# EAGLE design EC-TDS-PPM1_5 (EAGLE 7.5.0)
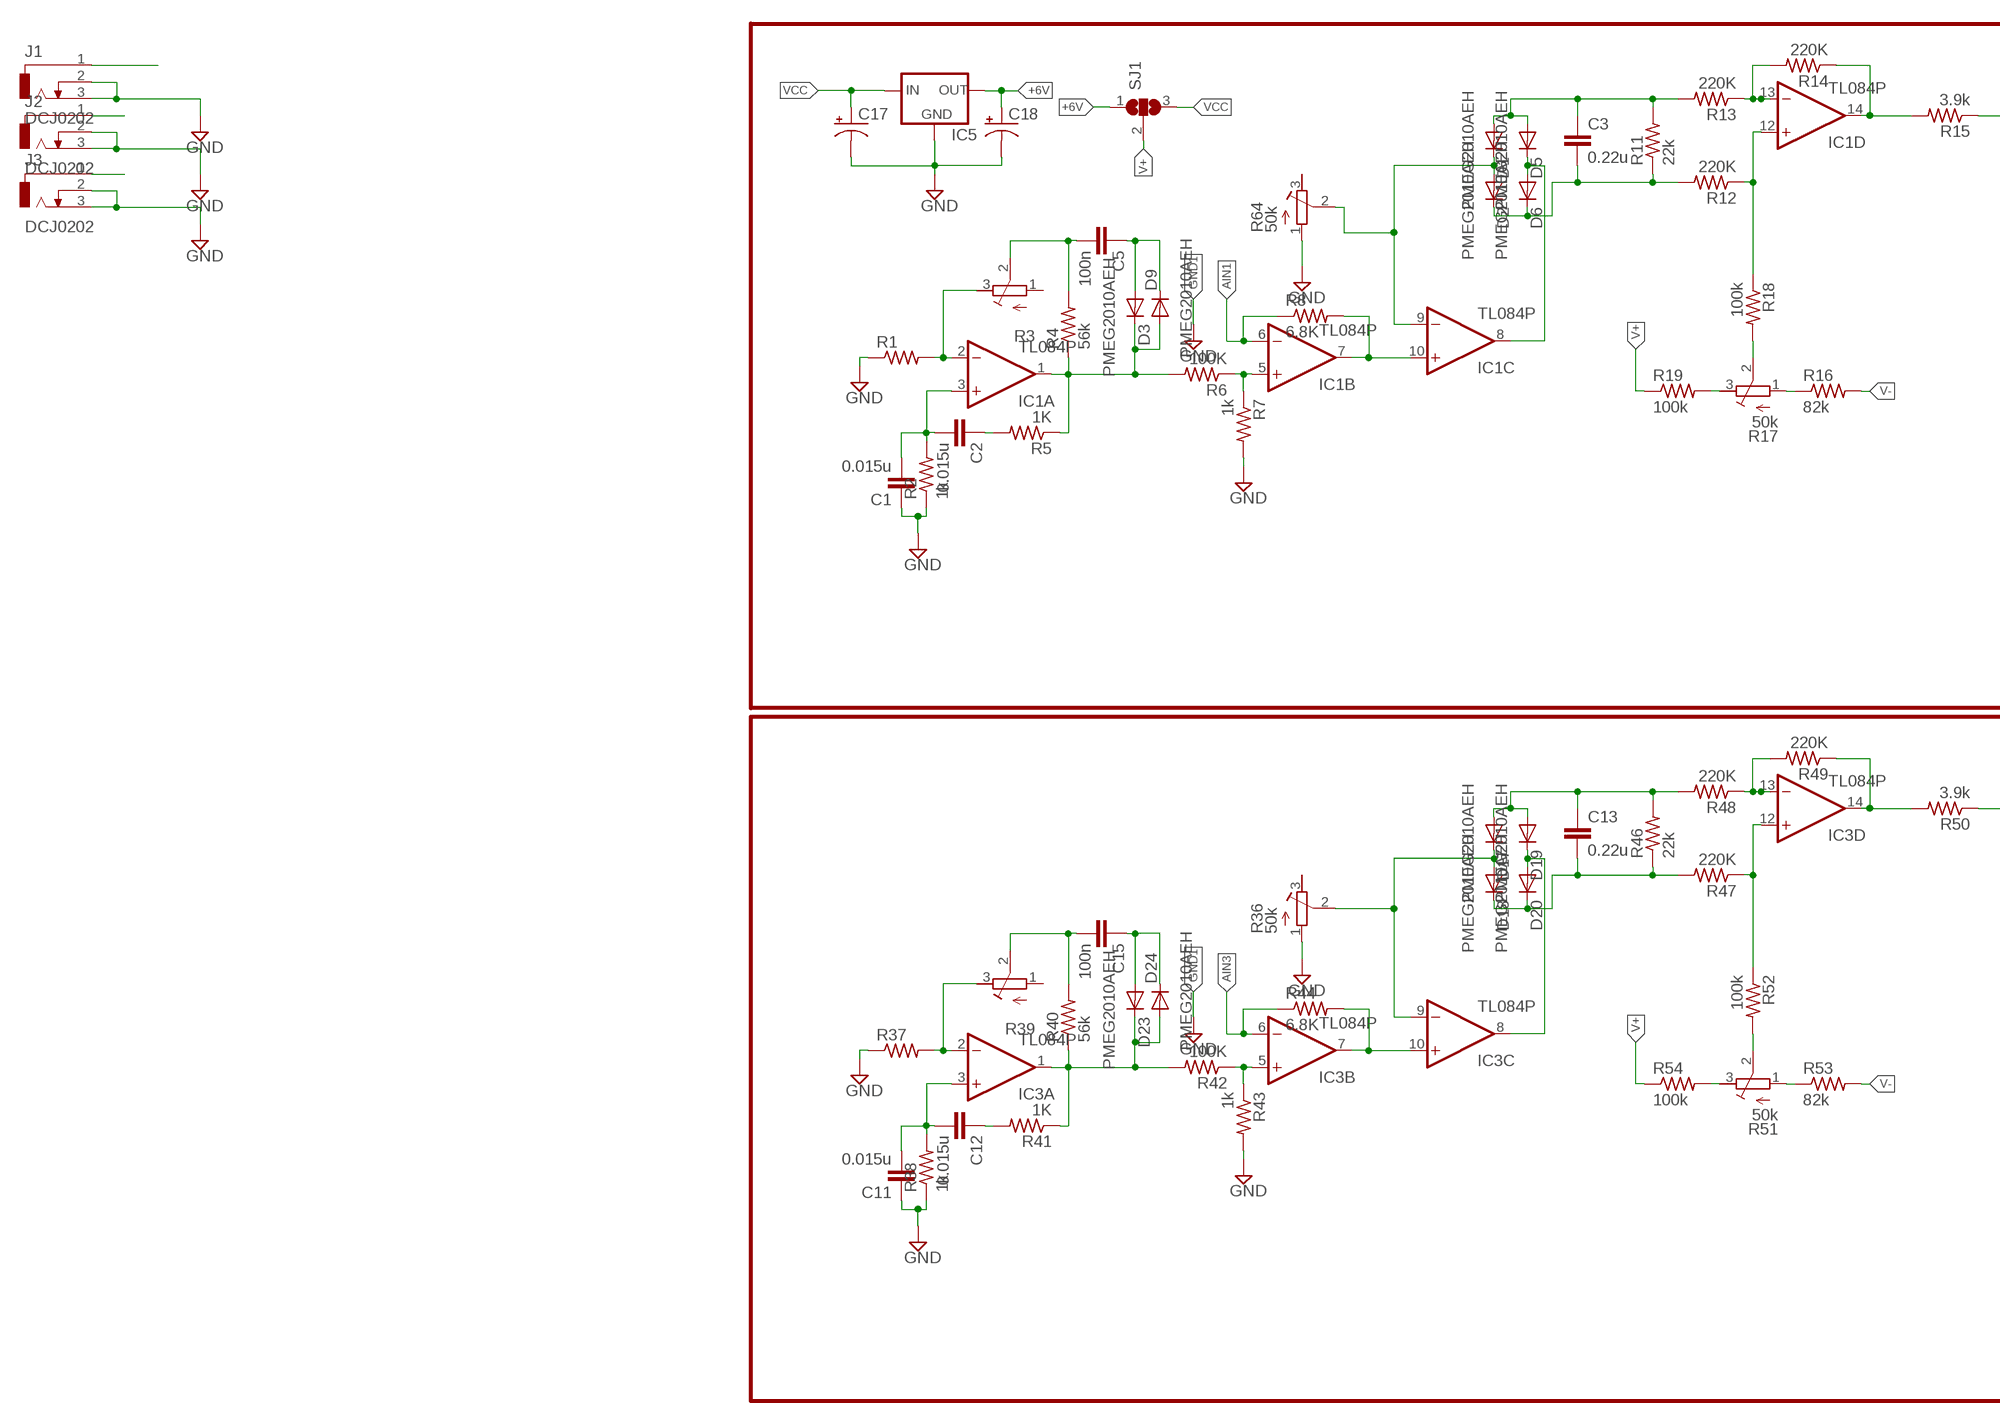
[diagram p0: schematic, sheet 1, part 1 of 2]
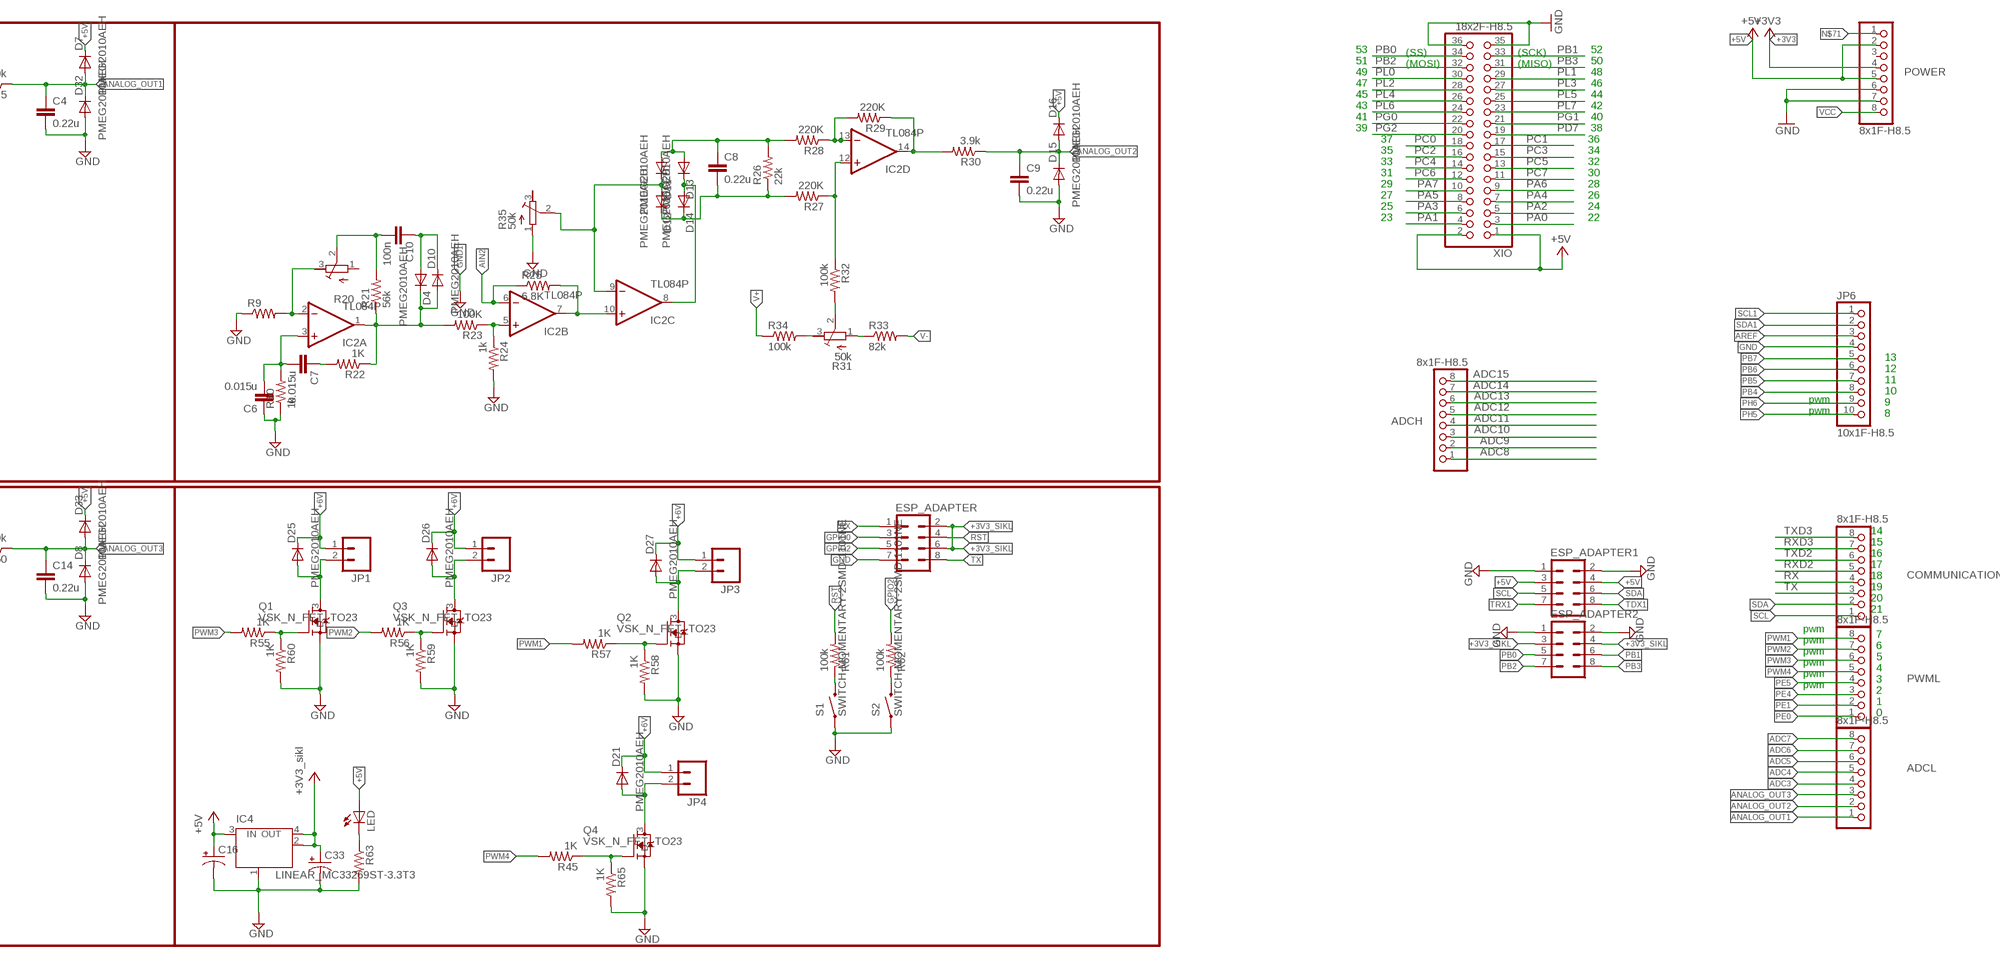
[diagram p1: schematic, sheet 1, part 2 of 2]

## Parts
ADCH  8x1F-H8.5  PINHD-1X8  [1X08]
ADCL  8x1F-H8.5  PINHD-1X8  [1X08]
C1  0.015u  C-EUC0603  [C0603]
C2  0.015u  C-EUC0603  [C0603]
C3  0.22u  C-EUC0603  [C0603]
C4  0.22u  C-EUC0603  [C0603]
C5  100n  C-EUC0603  [C0603]
C6  0.015u  C-EUC0603  [C0603]
C7  0.015u  C-EUC0603  [C0603]
C8  0.22u  C-EUC0603  [C0603]
C9  0.22u  C-EUC0603  [C0603]
C10  100n  C-EUC0603  [C0603]
C11  0.015u  C-EUC0603  [C0603]
C12  0.015u  C-EUC0603  [C0603]
C13  0.22u  C-EUC0603  [C0603]
C14  0.22u  C-EUC0603  [C0603]
C15  100n  C-EUC0603  [C0603]
C16  CPOL-USSMCC  [SMC_C]
C17  CPOL-USSMCC  [SMC_C]
C18  CPOL-USSMCC  [SMC_C]
C33  CPOL-USSMCC  [SMC_C]
COMMUNICATION  8x1F-H8.5  PINHD-1X8  [1X08]
D1  PMEG2010AEH  DIOD_SOT123F  [SOT123F]
D2  PMEG2010AEH  DIOD_SOT123F  [SOT123F]
D3  PMEG2010AEH  DIOD_SOT123F  [SOT123F]
D4  PMEG2010AEH  DIOD_SOT123F  [SOT123F]
D5  PMEG2010AEH  DIOD_SOT123F  [SOT123F]
D6  PMEG2010AEH  DIOD_SOT123F  [SOT123F]
D7  PMEG2010AEH  DIOD_SOT123F  [SOT123F]
D8  PMEG2010AEH  DIOD_SOT123F  [SOT123F]
D9  PMEG2010AEH  DIOD_SOT123F  [SOT123F]
D10  PMEG2010AEH  DIOD_SOT123F  [SOT123F]
D11  PMEG2010AEH  DIOD_SOT123F  [SOT123F]
D12  PMEG2010AEH  DIOD_SOT123F  [SOT123F]
D13  PMEG2010AEH  DIOD_SOT123F  [SOT123F]
D14  PMEG2010AEH  DIOD_SOT123F  [SOT123F]
D15  PMEG2010AEH  DIOD_SOT123F  [SOT123F]
D16  PMEG2010AEH  DIOD_SOT123F  [SOT123F]
D17  PMEG2010AEH  DIOD_SOT123F  [SOT123F]
D18  PMEG2010AEH  DIOD_SOT123F  [SOT123F]
D19  PMEG2010AEH  DIOD_SOT123F  [SOT123F]
D20  PMEG2010AEH  DIOD_SOT123F  [SOT123F]
D21  PMEG2010AEH  DIOD_SOT123F  [SOT123F]
D23  PMEG2010AEH  DIOD_SOT123F  [SOT123F]
D24  PMEG2010AEH  DIOD_SOT123F  [SOT123F]
D25  PMEG2010AEH  DIOD_SOT123F  [SOT123F]
D26  PMEG2010AEH  DIOD_SOT123F  [SOT123F]
D27  PMEG2010AEH  DIOD_SOT123F  [SOT123F]
D32  PMEG2010AEH  DIOD_SOT123F  [SOT123F]
D33  PMEG2010AEH  DIOD_SOT123F  [SOT123F]
ESP_ADAPTER  M04X2  [2X4]
ESP_ADAPTER1  M04X2  [2X4]
ESP_ADAPTER2  M04X2  [2X4]
IC1  TL084P  [DIL14]
IC2  TL084P  [DIL14]
IC3  TL084P  [DIL14]
IC4  LINEAR_MC33269ST-3.3T3  [LINEAR_SOT223]
IC5  78XXS  [78XXS]
J1  DCJ0202  [DCJ0202]
J2  DCJ0202  [DCJ0202]
J3  DCJ0202  [DCJ0202]
JP1  M02PTH  [1X02]
JP2  M02PTH  [1X02]
JP3  M02PTH  [1X02]
JP4  M02PTH  [1X02]
JP6  10x1F-H8.5  PINHD-1X10_ARD  [1X10]
LED  SPARKFUN_LED0603  [SPARKFUN_LED-0603]
POWER  8x1F-H8.5  PINHD-1X8  [1X08]
PWML  8x1F-H8.5  PINHD-1X8  [1X08]
Q1  VSK_N_FET_TO23  [SOT23]
Q2  VSK_N_FET_TO23  [SOT23]
Q3  VSK_N_FET_TO23  [SOT23]
Q4  VSK_N_FET_TO23  [SOT23]
R1  R-US_R0603  [R0603]
R2  1k  R-US_R0603  [R0603]
R3  R-TRIMM64W  [RTRIM64W]
R4  56k  R-US_R0603  [R0603]
R5  1K  R-US_R0603  [R0603]
R6  100K  R-US_R0603  [R0603]
R7  1k  R-US_R0603  [R0603]
R8  6.8K  R-US_R0603  [R0603]
R9  R-US_R0603  [R0603]
R10  1k  R-US_R0603  [R0603]
R11  22k  R-US_R0603  [R0603]
R12  220K  R-US_R0603  [R0603]
R13  220K  R-US_R0603  [R0603]
R14  220K  R-US_R0603  [R0603]
R15  3.9k  R-US_R0603  [R0603]
R16  82k  R-US_R0603  [R0603]
R17  50k  R-TRIMM64W  [RTRIM64W]
R18  100k  R-US_R0603  [R0603]
R19  100k  R-US_R0603  [R0603]
R20  R-TRIMM64W  [RTRIM64W]
R21  56k  R-US_R0603  [R0603]
R22  1K  R-US_R0603  [R0603]
R23  100K  R-US_R0603  [R0603]
R24  1k  R-US_R0603  [R0603]
R25  6.8K  R-US_R0603  [R0603]
R26  22k  R-US_R0603  [R0603]
R27  220K  R-US_R0603  [R0603]
R28  220K  R-US_R0603  [R0603]
R29  220K  R-US_R0603  [R0603]
R30  3.9k  R-US_R0603  [R0603]
R31  50k  R-TRIMM64W  [RTRIM64W]
R32  100k  R-US_R0603  [R0603]
R33  82k  R-US_R0603  [R0603]
R34  100k  R-US_R0603  [R0603]
R35  50k  R-TRIMM64W  [RTRIM64W]
R36  50k  R-TRIMM64W  [RTRIM64W]
R37  R-US_R0603  [R0603]
R38  1k  R-US_R0603  [R0603]
R39  R-TRIMM64W  [RTRIM64W]
R40  56k  R-US_R0603  [R0603]
R41  1K  R-US_R0603  [R0603]
R42  100K  R-US_R0603  [R0603]
R43  1k  R-US_R0603  [R0603]
R44  6.8K  R-US_R0603  [R0603]
R45  1K  R-US_R0603  [R0603]
R46  22k  R-US_R0603  [R0603]
R47  220K  R-US_R0603  [R0603]
R48  220K  R-US_R0603  [R0603]
R49  220K  R-US_R0603  [R0603]
R50  3.9k  R-US_R0603  [R0603]
R51  50k  R-TRIMM64W  [RTRIM64W]
R52  100k  R-US_R0603  [R0603]
R53  82k  R-US_R0603  [R0603]
R54  100k  R-US_R0603  [R0603]
R55  1K  R-US_R0603  [R0603]
R56  1K  R-US_R0603  [R0603]
R57  1K  R-US_R0603  [R0603]
R58  1K  R-US_R0603  [R0603]
R59  1K  R-US_R0603  [R0603]
R60  1K  R-US_R0603  [R0603]
R61  100k  R-US_R0603  [R0603]
R62  100k  R-US_R0603  [R0603]
R63  SPARKFUN_RESISTOR0603-RES  [SPARKFUN_0603-RES]
R64  50k  R-TRIMM64W  [RTRIM64W]
R65  1K  R-US_R0603  [R0603]
S1  SWITCH-MOMENTARY-2SMD-1101NE  [TACTILE-SWITCH-1101NE]
S2  SWITCH-MOMENTARY-2SMD-1101NE  [TACTILE-SWITCH-1101NE]
SJ1  SJ2WW  [SJ_2W]
XIO  18x2F-H8.5  PINHD-2X18  [2X18]

## Nets
+3V3: POWER.4
+3V3_SIKL: C33.+ ESP_ADAPTER2.3 ESP_ADAPTER2.4 ESP_ADAPTER.2 ESP_ADAPTER.6 IC4.2(OUT) IC4.4(OUT) ; supply symbol labelled +3V3_sikl
+5V: C16.+ D7.C D16.C D33.C ESP_ADAPTER1.3 ESP_ADAPTER1.4 IC4.3(IN) LED.A POWER.2 POWER.5 XIO.1 XIO.2
+6V: C18.+ D21.C D25.C D26.C D27.C IC5.OUT JP1.1 JP2.1 JP3.1 JP4.1 SJ1.1
ADC3: ADCL.4
ADC4: ADCL.5
ADC5: ADCL.6
ADC6: ADCL.7
ADC7: ADCL.8
ADC8: ADCH.1
ADC9: ADCH.2
ADC10: ADCH.3
ADC11: ADCH.4
ADC12: ADCH.5
ADC13: ADCH.6
ADC14: ADCH.7
ADC15: ADCH.8
AIN1: IC1.6(B:-IN) J1.1 R8.1
AIN2: IC2.6(B:-IN) J2.1 R25.1
AIN3: IC3.6(B:-IN) J3.1 R44.1
ANALOG_OUT1: ADCL.1 C4.1 D7.A D32.C R15.1
ANALOG_OUT2: ADCL.2 C9.1 D15.C D16.A R30.1
ANALOG_OUT3: ADCL.3 C14.1 D8.C D33.A R50.1
AREF: JP6.3
GND: ESP_ADAPTER.7 JP6.4 POWER.6 POWER.7 XIO.35 XIO.36
GND1: C1.1 C4.2 C6.1 C9.2 C11.1 C14.2 C16.- C17.- C18.- C33.- D8.A D15.A D32.A ESP_ADAPTER1.1 ESP_ADAPTER1.2 ESP_ADAPTER2.1 ESP_ADAPTER2.2 IC4.1(GND/ADJ) IC5.GND J1.2 J1.3 J2.2 J2.3 J3.2 J3.3 Q1.2(S) Q2.2(S) Q3.2(S) Q4.2(S) R1.1 R2.1 R7.2 R9.1 R10.1 R24.2 R35.1(A) R36.1(A) R37.1 R38.1 R43.2 R58.2 R59.2 R60.2 R63.2 R64.1(A) R65.2 S1.1 S2.1 ; supply symbol labelled GND
GPIO0: ESP_ADAPTER.3
GPIO2: ESP_ADAPTER.5 R62.2
N$1: IC1.2(A:-IN) R1.2 R3.3(E)
N$2: C2.1 R5.2
N$3: C1.2 C2.2 IC1.3(A:+IN) R2.2
N$4: IC1.5(B:+IN) R6.1 R7.1
N$5: C5.2 R3.2(S) R4.2
N$6: R16.1 R17.1(A)
N$7: D3.C D9.A IC1.1(A:OUT) R4.1 R5.1 R6.2
N$8: C5.1 D3.A D9.C
N$9: IC1.7(B:OUT) IC1.10(C:+IN) R8.2
N$10: R17.3(E) R19.2
N$11: IC1.13(D:-IN) R13.1 R14.2
N$12: C3.1 D1.A D5.A R11.2 R13.2
N$13: D1.C D2.A IC1.9(C:-IN) R64.2(S)
N$14: C3.2 D2.C D6.C R11.1 R12.2
N$15: D5.C D6.A IC1.8(C:OUT)
N$16: IC1.12(D:+IN) R12.1 R18.1
N$17: IC1.14(D:OUT) R14.1 R15.2
N$18: R17.2(S) R18.2
N$19: IC2.2(A:-IN) R9.2 R20.3(E)
N$20: C6.2 C7.2 IC2.3(A:+IN) R10.2
N$21: C10.2 R20.2(S) R21.2
N$22: D4.C D10.A IC2.1(A:OUT) R21.1 R22.1 R23.2
N$23: C7.1 R22.2
N$24: IC2.5(B:+IN) R23.1 R24.1
N$25: IC2.7(B:OUT) IC2.10(C:+IN) R25.2
N$26: C8.1 D11.A D13.A R26.2 R28.2
N$27: D11.C D12.A IC2.9(C:-IN) R35.2(S)
N$28: C8.2 D12.C D14.C R26.1 R27.2
N$29: D13.C D14.A IC2.8(C:OUT)
N$30: IC2.13(D:-IN) R28.1 R29.2
N$31: IC2.12(D:+IN) R27.1 R32.1
N$32: IC2.14(D:OUT) R29.1 R30.2
N$33: C10.1 D4.A D10.C
N$34: R31.1(A) R33.1
N$35: R31.3(E) R34.2
N$36: R31.2(S) R32.2
N$37: IC3.2(A:-IN) R37.2 R39.3(E)
N$38: C11.2 C12.2 IC3.3(A:+IN) R38.2
N$39: C15.2 R39.2(S) R40.2
N$40: D23.C D24.A IC3.1(A:OUT) R40.1 R41.1 R42.2
N$41: C12.1 R41.2
N$42: IC3.5(B:+IN) R42.1 R43.1
N$43: IC3.7(B:OUT) IC3.10(C:+IN) R44.2
N$44: C13.1 D17.A D19.A R46.2 R48.2
N$45: D17.C D18.A IC3.9(C:-IN) R36.2(S)
N$46: C13.2 D18.C D20.C R46.1 R47.2
N$47: D19.C D20.A IC3.8(C:OUT)
N$48: IC3.13(D:-IN) R48.1 R49.2
N$49: IC3.12(D:+IN) R47.1 R52.1
N$50: IC3.14(D:OUT) R49.1 R50.2
N$51: C15.1 D23.A D24.C
N$52: R51.1(A) R53.1
N$53: R51.3(E) R54.2
N$54: R51.2(S) R52.2
N$55: D26.A JP2.2 Q3.3(D)
N$56: D27.A JP3.2 Q2.3(D)
N$57: D25.A JP1.2 Q1.3(D)
N$58: Q2.1(G) R57.1 R58.1
N$59: Q3.1(G) R56.1 R59.1
N$60: D21.A JP4.2 Q4.3(D)
N$61: Q1.1(G) R55.1 R60.1
N$62: R61.1 S1.2
N$63: R62.1 S2.2
N$64: LED.C R63.1
N$65: Q4.1(G) R45.1 R65.1
N$71: POWER.1
PA0: XIO.3
PA1: XIO.4
PA2: XIO.5
PA3: XIO.6
PA4: XIO.7
PA5: XIO.8
PA6: XIO.9
PA7: XIO.10
PB0: ESP_ADAPTER2.5 XIO.34
PB1: ESP_ADAPTER2.6 XIO.33
PB2: ESP_ADAPTER2.7 XIO.32
PB3: ESP_ADAPTER2.8 XIO.31
PB4: JP6.8
PB5: JP6.7
PB6: JP6.6
PB7: JP6.5
PC0: XIO.18
PC1: XIO.17
PC2: XIO.16
PC3: XIO.15
PC4: XIO.14
PC5: XIO.13
PC6: XIO.12
PC7: XIO.11
PD7: XIO.19
PE0: PWML.1
PE1: PWML.2
PE4: PWML.3
PE5: PWML.4
PG0: XIO.22
PG1: XIO.21
PG2: XIO.20
PH5: JP6.10
PH6: JP6.9
PL0: XIO.30
PL1: XIO.29
PL2: XIO.28
PL3: XIO.27
PL4: XIO.26
PL5: XIO.25
PL6: XIO.24
PL7: XIO.23
PWM1: PWML.8 R57.2
PWM2: PWML.7 R56.2
PWM3: PWML.6 R55.2
PWM4: PWML.5 R45.2
RST: ESP_ADAPTER.4 R61.2
RX: COMMUNICATION.4 ESP_ADAPTER.1
RXD2: COMMUNICATION.5
RXD3: COMMUNICATION.7
SCL: COMMUNICATION.1 ESP_ADAPTER1.5
SCL1: JP6.1
SDA: COMMUNICATION.2 ESP_ADAPTER1.6
SDA1: JP6.2
TDX1: ESP_ADAPTER1.8
TRX1: ESP_ADAPTER1.7
TX: COMMUNICATION.3 ESP_ADAPTER.8
TXD2: COMMUNICATION.6
TXD3: COMMUNICATION.8
V+: R19.1 R34.1 R54.1 SJ1.2
V-: R16.2 R33.2 R53.2
VCC [power]: C17.+ IC5.IN POWER.8 SJ1.3
Unconnected: POWER.3 R3.1(A) R20.1(A) R35.3(E) R36.3(E) R39.1(A) R64.3(E)

## Notes on the sheet
- 53 | (SS) | (SCK) | 52
- 51 | (MOSI) | (MISO) | 50
- 49 | 48
- 47 | 46
- 45 | 44
- 43 | 42
- 41 | 40
- 39 | 38
- 37 | 36
- 35 | 34
- 33 | 32
- 31 | 30
- 29 | 28
- 27 | 26
- 25 | 24
- 23 | 22
- 13
- 12
- 11
- 10
- pwm | 9
- pwm | 8
- 14
- 15
- 16
- 17
- 18
- 19
- 20
- 21
- pwm
- 7
- pwm
- 6
- pwm
- 5
- pwm
- 4
- pwm
- 3
- pwm
- 2
- 1
- 0

## Power pins joined to a net without a drawn wire
V+: IC1.4(P:V+) IC2.4(P:V+) IC3.4(P:V+)
V-: IC1.11(P:V-) IC2.11(P:V-) IC3.11(P:V-)

## Library data of the parts
ADCH ADCL COMMUNICATION POWER PWML = SmartPrj:PINHD-1X8: PIN HEADER
C1-C15 = resistor:C-EU: CAPACITOR, European symbol
C16-C18 C33 = rcl:CPOL-US: POLARIZED CAPACITOR, American symbol
D1-D21 D23-D27 D32 D33 = Enleka_Diode:DIOD_SOT123F; PARTNO: PMEG2010AEH,115
ESP_ADAPTER ESP_ADAPTER1 ESP_ADAPTER2 = SparkFun-Connectors:M04X2: .1" header, two rows of four.
IC1-IC3 = linear:TL084: OP AMP
IC4 = Robotech_Other:LINEAR_MC33269ST*: Adjustable Output Low Dropout Voltage Regulator 800 mA Source: http://www.onsemi.com/pub/Collateral/MC33269-D.PDF
IC5 = v-reg:78XXS: VOLTAGE REGULATOR
J1-J3 = con-jack:DCJ0202: DC POWER JACK Source: DCJ0202.pdf; OC_FARNELL: unknown; OC_NEWARK: unknown
JP1-JP4 = SparkFun-Connectors:M02: Standard 2-pin 0.1" header. Use with - straight break away headers ( PRT-00116) - right angle break away headers (PRT-00553) - swiss pins (PRT-00743) - machine pins (PRT-00117) - female headers (PRT-00115) Molex polarized connector foot print use with: PRT-08233 with associated crimp pins and housings. 2.54_SCREWTERM for use with PRT-10571. 3.5mm Screw Terminal footprints for PRT-08084 5mm Screw Terminal footprints for use with PRT-08432
JP6 = SmartPrj:PINHD-1X10_ARD: PIN HEADER
LED = Robotech RLC of Chung:SPARKFUN_LED: LEDs Standard schematic elements and footprints for 5mm, 3mm, 1206, and 0603 sized LEDs. 5mm - Spark Fun Electronics SKU : COM-00529 (and others)
Q1-Q4 = transistor-fet:VSK_N_FET_TO23
R1 R2 R4-R16 R18 R19 R21-R30 R32-R34 R37 R38 R40-R50 R52-R62 R65 = resistor:R-US_: RESISTOR, American symbol
R3 R17 R20 R31 R35 R36 R39 R51 R64 = resistor:R-TRIMM: Trimm resistor
R63 = Robotech_RCL:SPARKFUN_RESISTOR: Resistor Basic schematic elements and footprints for 0603, 1206, and PTH resistors.
S1 S2 = SparkFun-Electromechanical:SWITCH-MOMENTARY-2: Various NO switches- pushbuttons, reed, etc; PROD_ID: SWCH-00815
SJ1 = jumper:SJ2W: SMD solder JUMPER
XIO = SmartPrj:PINHD-2X18: PIN HEADER

## Net classes
0 default: width 0.203 mm, drill 0.406 mm, clearance 0.203 mm
1 power: width 0.61 mm, drill 0.406 mm, clearance 0.203 mm
2 gnd: width 0.305 mm, drill 0.406 mm, clearance 0.203 mm
3 power usb: width 0.508 mm, drill 0.406 mm, clearance 0.203 mm

## Board
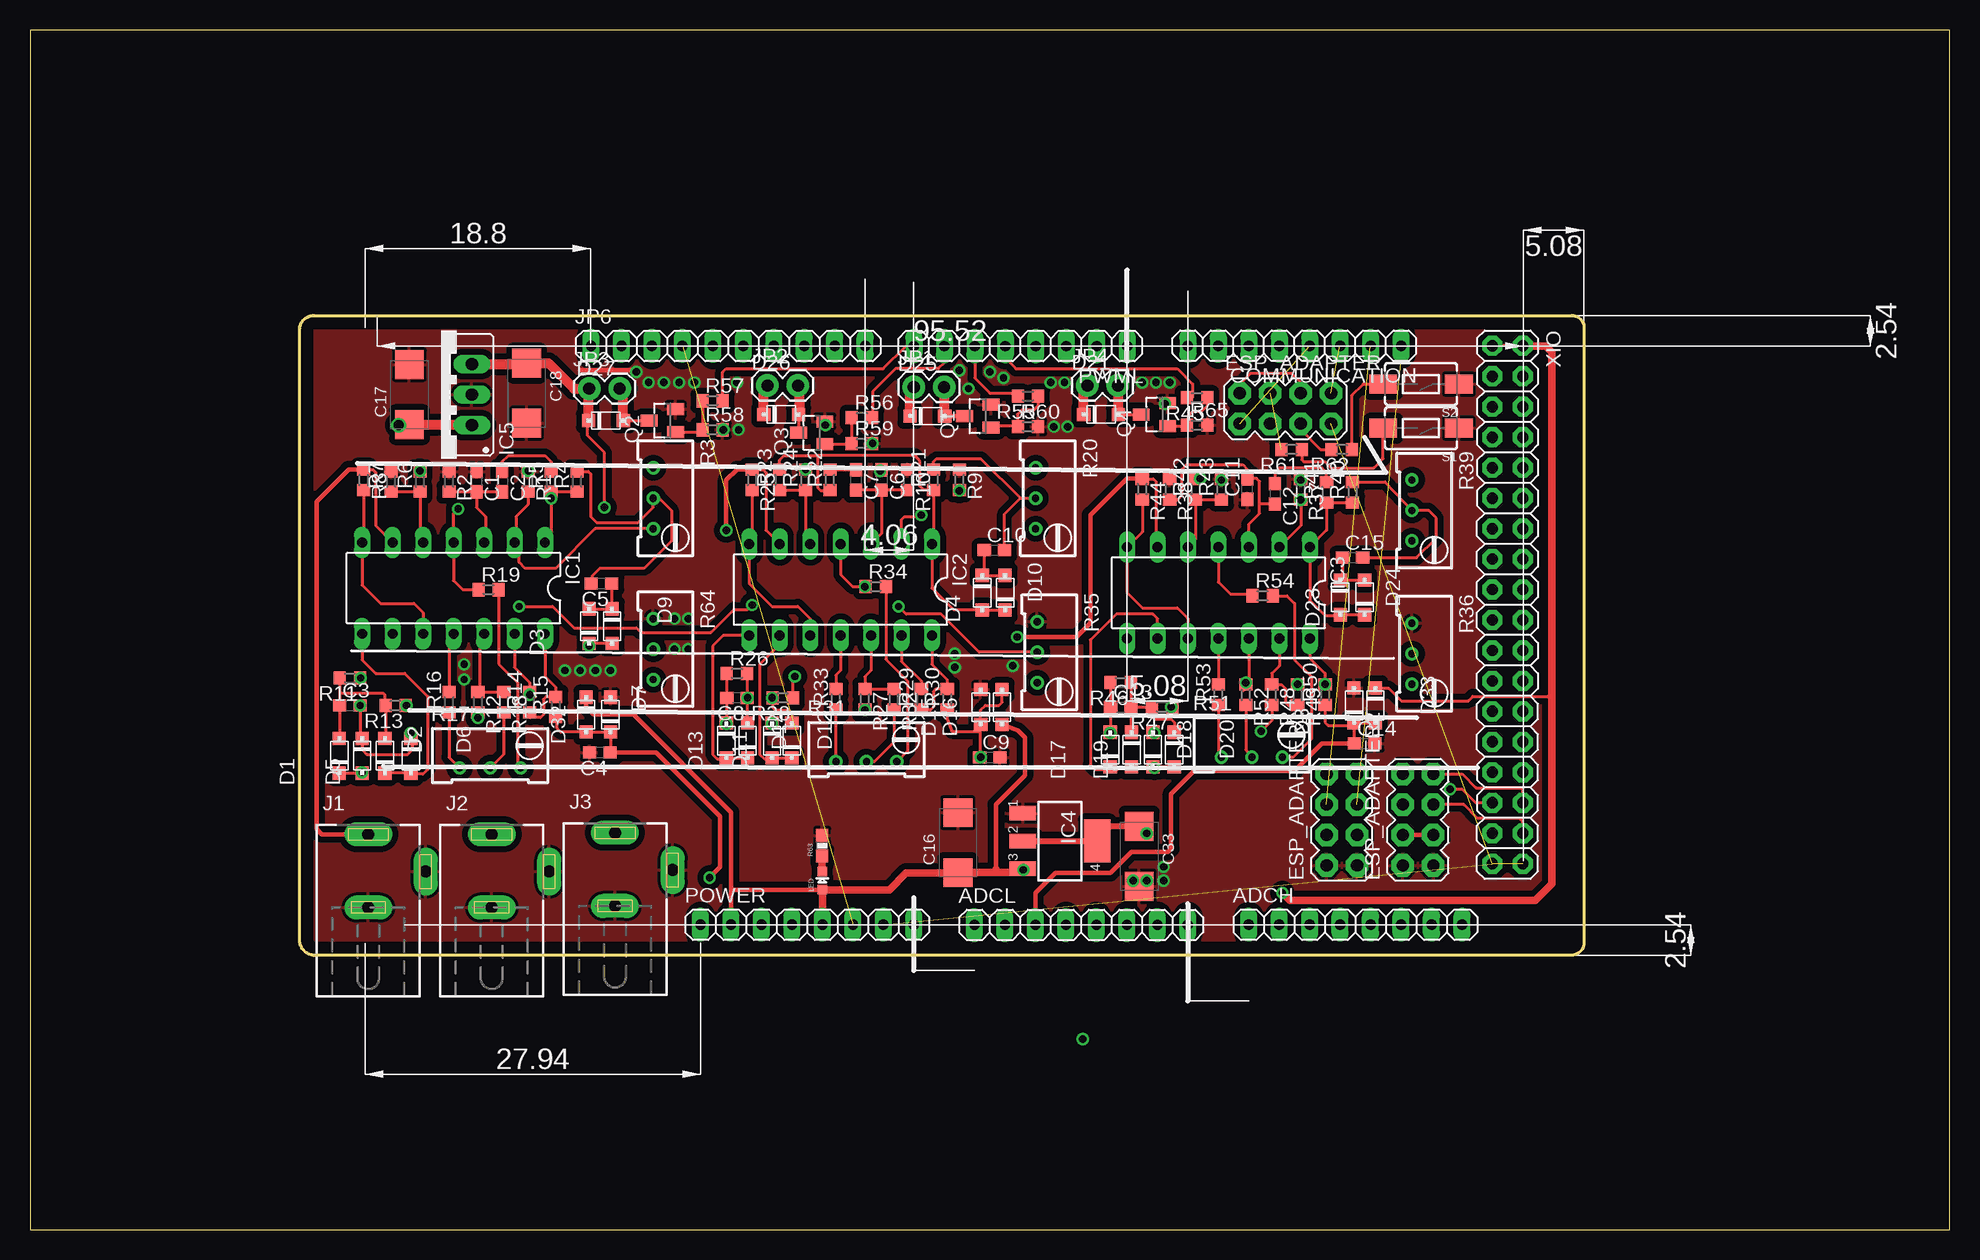
[diagram p2: board, top side]
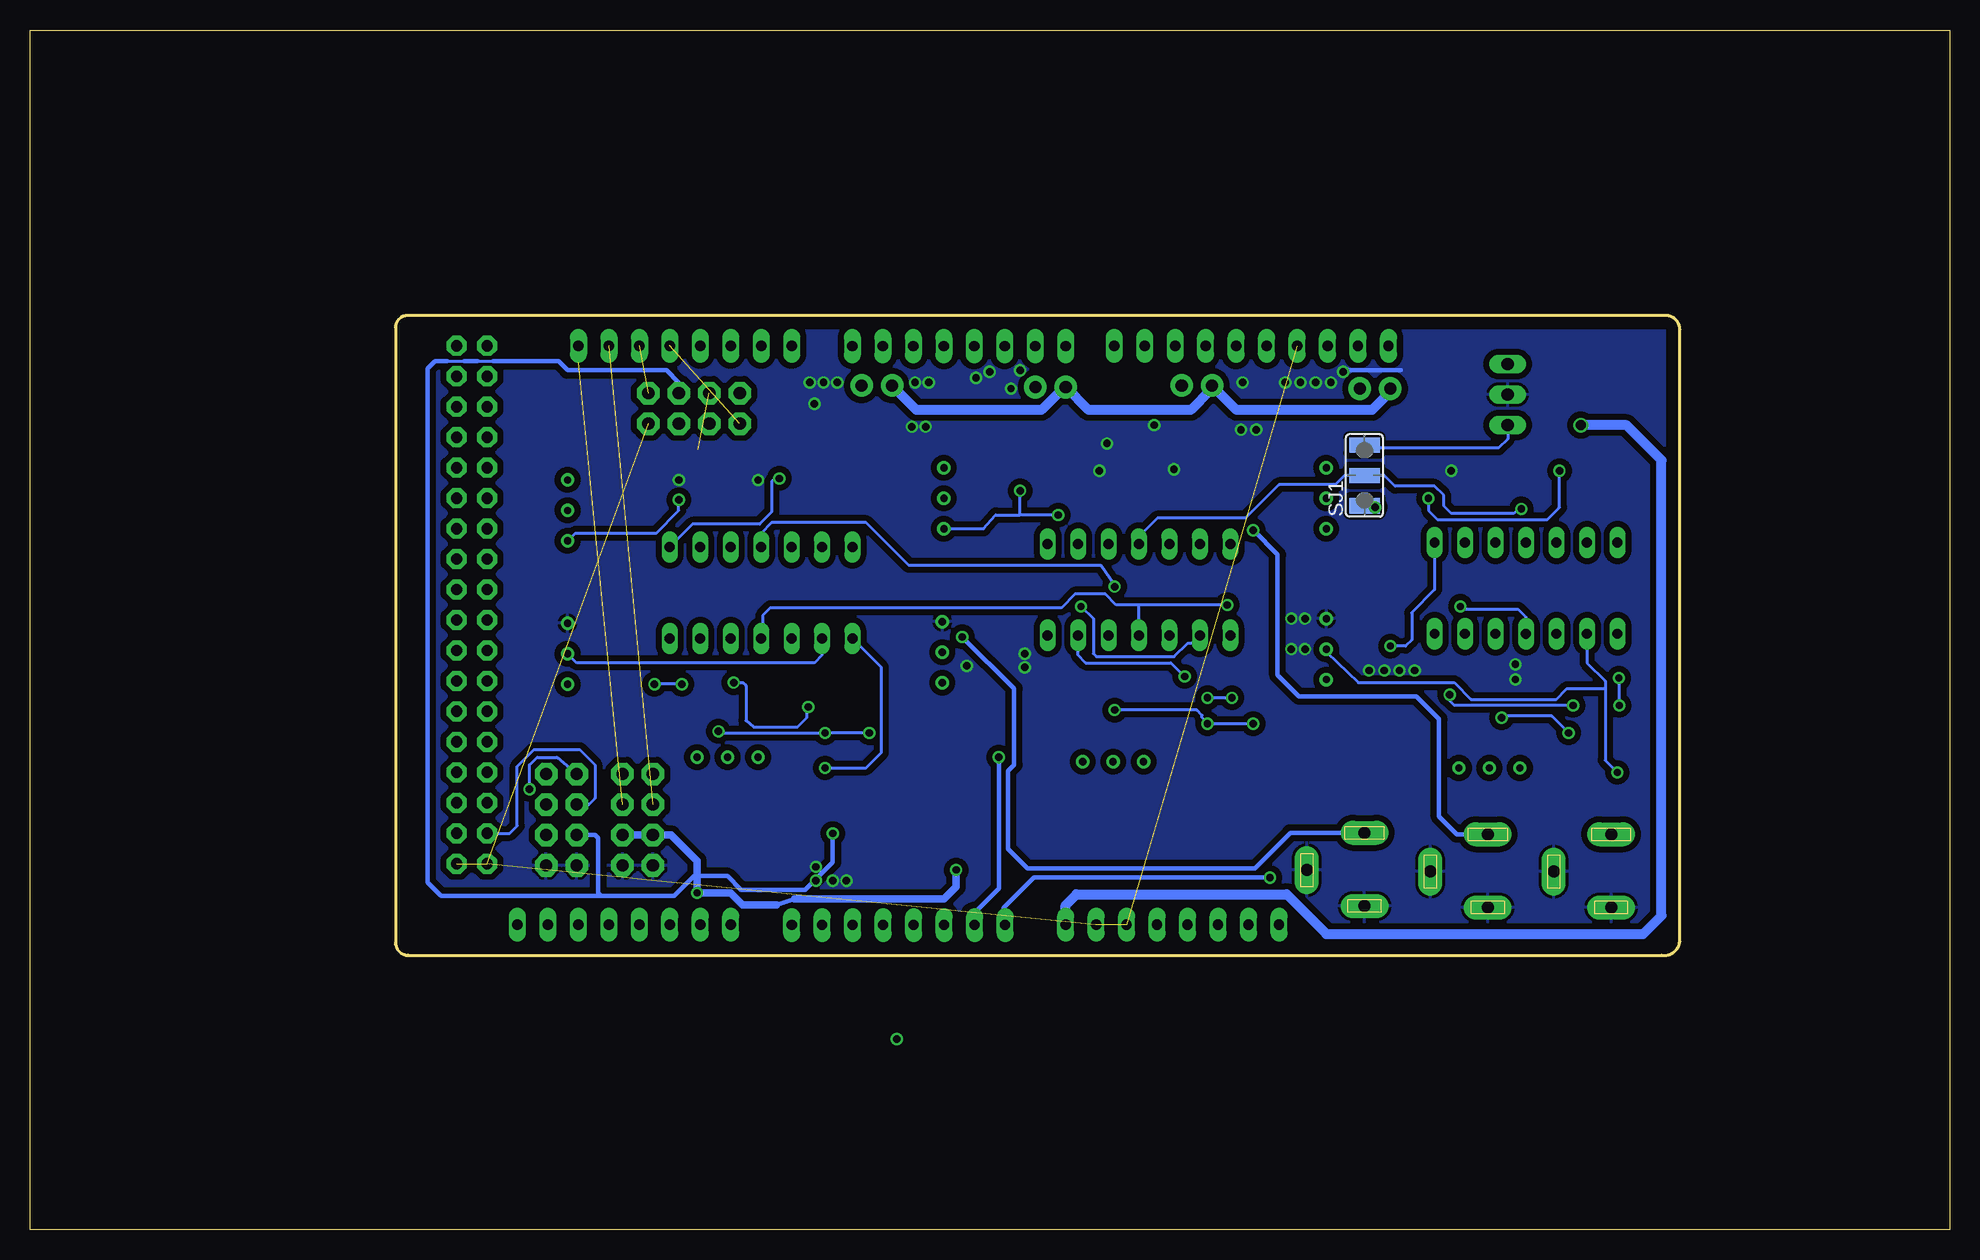
[diagram p3: board, bottom side, seen from below]

Size 160 x 100 mm. Coordinates in mm from the lower left corner, seen from the top.
Outline: 0,0 160,0 160,100 0,100 0,0
Outline: 22.48,23.98 22.48,75.03 arc-90 23.65,76.19 128.52,76.19 arc-90 129.54,75.18 129.54,23.95 arc-90 128.44,22.86 23.99,22.86 arc-90 22.48,23.98
Copper layers (1*16): Top 0.035mm / dielectric 1.5mm / Bottom 0.035mm
Design rules "default *": minimum track width 10mil, minimum drill 24mil, track to track 10mil, track to pad 10mil, pad to pad 10mil, via to via 10mil, smd to smd 8mil, copper to edge 40mil, drill to drill 8mil, minimum pad ring 10mil, minimum via ring 8mil, stop-mask expansion 4mil, vias tented up to drill 100mil, thermal gap 10mil

### Footprints (pad centres in the part's own frame; a part is rotated, then mirrored left to right if it is on the bottom)
1X08 = drill 0.85 pad 1.422 long: 1 -8.89,0; 2 -6.35,0; 3 -3.81,0; 4 -1.27,0; 5 1.27,0; 6 3.81,0; 7 6.35,0; 8 8.89,0
C0603 = smd 1.1 x 1: 1 -0.85,0; 2 0.85,0
SMC_C = smd 2.4 x 2.4: + -2.5,0; - 2.5,0
SOT123F = smd 1.1 x 1.1: A 1.45,0; C -1.45,0
2X4 = drill 1.016 pad 1.88 octagon: 1 -3.81,-1.27; 2 -3.81,1.27; 3 -1.27,-1.27; 4 -1.27,1.27; 5 1.27,-1.27; 6 1.27,1.27; 7 3.81,-1.27; 8 3.81,1.27
DIL14 = drill 0.813 long: 1 -7.62,-3.81; 2 -5.08,-3.81; 3 -2.54,-3.81; 4 0,-3.81; 5 2.54,-3.81; 6 5.08,-3.81; 7 7.62,-3.81; 8 7.62,3.81; 9 5.08,3.81; 10 2.54,3.81; 11 0,3.81; 12 -2.54,3.81; 13 -5.08,3.81; 14 -7.62,3.81
LINEAR_SOT223 = smd 1.219 x 2.235: 1 -2.311,-3.099; 2 0,-3.099; 3 2.311,-3.099 | smd 3.6 x 2.2: 4 0,3.099
78XXS = drill 1.016 long: GND 0,-2.54; IN -2.54,-2.54; OUT 2.54,-2.54
DCJ0202 = drill 1 pad 2 long: 1 0,3.1; 2 4.8,0; 3 0,-3
1X02 = drill 1.016 pad 1.88: 1 0,0; 2 2.54,0
1X10 = drill 0.85 pad 1.422 long: 1 -11.43,0; 2 -8.89,0; 3 -6.35,0; 4 -3.81,0; 5 -1.27,0; 6 1.27,0; 7 3.81,0; 8 6.35,0; 9 8.89,0; 10 11.43,0
SPARKFUN_LED-0603 = smd 0.8 x 0.8: A 0,-0.75; C 0,0.75
SOT23 = smd 1 x 1.4: 1 -0.95,-1.1; 2 0.95,-1.1; 3 0,1.1
R0603 = smd 1 x 1.1: 1 -0.85,0; 2 0.85,0
RTRIM64W = drill 0.61: 1 1.27,-2.54; 2 1.27,0; 3 1.27,2.54
SPARKFUN_0603-RES = smd 1.1 x 1: 1 -0.85,0; 2 0.85,0
TACTILE-SWITCH-1101NE = smd 2.3 x 1.6: 1 -3.15,0; 2 3.15,0
SJ_2W = smd 1.27 x 2.54: 1 -2.54,0; 2 0,0; 3 2.54,0
2X18 = drill 0.95 pad 1.676 octagon: 1 -21.59,-1.27; 2 -21.59,1.27; 3 -19.05,-1.27; 4 -19.05,1.27; 5 -16.51,-1.27; 6 -16.51,1.27; 7 -13.97,-1.27; 8 -13.97,1.27; 9 -11.43,-1.27; 10 -11.43,1.27; 11 -8.89,-1.27; 12 -8.89,1.27; 13 -6.35,-1.27; 14 -6.35,1.27; 15 -3.81,-1.27; 16 -3.81,1.27; 17 -1.27,-1.27; 18 -1.27,1.27; 19 1.27,-1.27; 20 1.27,1.27; 21 3.81,-1.27; 22 3.81,1.27; 23 6.35,-1.27; 24 6.35,1.27; 25 8.89,-1.27; 26 8.89,1.27; 27 11.43,-1.27; 28 11.43,1.27; 29 13.97,-1.27; 30 13.97,1.27; 31 16.51,-1.27; 32 16.51,1.27; 33 19.05,-1.27; 34 19.05,1.27; 35 21.59,-1.27; 36 21.59,1.27

### Placement (x,y rotation side)
ADCH  110.48,25.41 0 top
ADCL  87.62,25.39 0 top
C1  37.21,62.36 270 top
C2  39.37,62.36 270 top
C3  26.67,43.69 0 top
C4  47.5,39.75 180 top
C5  47.62,53.85 180 top
C6  70.99,62.48 270 top
C7  68.83,62.48 270 top
C8  58.93,44.32 180 top
C9  80.01,39.37 0 top
C10  80.39,56.64 0 top
C11  101.47,61.72 90 top
C12  103.76,61.34 270 top
C13  90.93,43.56 0 top
C14  111.25,40.51 0 top
C15  110.24,56.01 0 top
C16  77.34,32.26 90 top
C17  31.62,69.6 90 top
C18  41.4,69.72 270 top
C33  92.46,31.11 270 top
COMMUNICATION  105.4,73.67 180 top
D1  25.78,39.5 90 top
D2  27.69,39.5 270 top
D3  46.61,50.29 90 top
D4  81.28,53.09 90 top
D5  29.59,39.5 90 top
D6  31.75,39.5 270 top
D7  46.35,42.93 270 top
D8  110.36,43.69 90 top
D9  48.51,50.29 270 top
D10  79.38,53.09 270 top
D11  63.5,40.77 90 top
D12  61.85,40.77 270 top
D13  59.82,40.77 90 top
D14  58.04,40.77 270 top
D15  79.25,43.56 90 top
D16  81.03,43.56 90 top
D17  90.04,40.01 90 top
D18  91.82,40.01 270 top
D19  93.6,40.01 90 top
D20  95.38,40.01 270 top
D21  89.28,67.94 0 top
D23  111.25,52.7 90 top
D24  109.22,52.7 270 top
D25  74.8,67.82 0 top
D26  62.61,67.94 0 top
D27  48.01,67.44 0 top
D32  48.39,42.93 90 top
D33  112.14,43.69 270 top
ESP_ADAPTER  104.65,68.45 0 top
ESP_ADAPTER1  109.35,34.16 90 top
ESP_ADAPTER2  115.7,34.16 90 top
IC1  35.31,53.47 180 top
IC2  67.56,53.34 180 top
IC3  99.06,53.09 180 top
IC4  85.85,32.38 270 top
IC5  34.29,69.6 90 top
J1  28.19,29.84 0 top
J2  38.48,29.84 0 top
J3  48.77,29.97 0 top
JP1  73.66,70.23 0 top
JP2  61.47,70.36 0 top
JP3  46.61,70.1 0 top
JP4  88.14,70.36 0 top
JP6  58.19,73.66 0 top
LED  66.04,29.08 0 top
POWER  64.78,25.41 0 top
PWML  82.56,73.65 180 top
Q1  78.99,67.82 90 top
Q2  52.7,67.44 90 top
Q3  65.15,66.42 90 top
Q4  93.73,67.94 90 top
R1  41.53,62.36 270 top
R2  34.92,62.36 270 top
R3  53.21,60.96 180 top
R4  45.59,62.36 90 top
R5  43.43,62.36 90 top
R6  32.51,62.36 90 top
R7  30.1,62.36 90 top
R8  27.81,62.48 270 top
R9  77.47,62.48 270 top
R10  73.15,62.48 270 top
R11  26.67,45.97 180 top
R12  37.34,43.94 270 top
R13  30.48,43.69 180 top
R14  41.66,43.94 90 top
R15  43.81,43.56 90 top
R16  34.92,43.94 90 top
R17  38.35,39.75 270 top
R18  39.5,43.94 270 top
R19  38.23,53.34 0 top
R20  85.09,60.96 180 top
R21  75.31,62.48 90 top
R22  66.67,62.48 90 top
R23  62.48,62.48 90 top
R24  64.64,62.48 90 top
R25  60.2,62.48 270 top
R26  58.93,46.35 0 top
R27  69.6,44.2 270 top
R28  62.74,44.32 180 top
R29  74.3,44.2 90 top
R30  76.45,44.2 90 top
R31  69.72,40.26 270 top
R32  72.01,44.2 270 top
R33  67.18,44.2 90 top
R34  70.48,53.59 0 top
R35  85.22,48.13 180 top
R36  116.46,48.01 180 top
R37  105.92,61.72 270 top
R38  95,61.72 270 top
R39  116.46,59.94 180 top
R40  110.24,61.47 90 top
R41  108.08,61.47 90 top
R42  97.16,61.72 90 top
R43  99.31,61.72 90 top
R44  92.71,61.72 270 top
R45  97.28,69.34 180 top
R46  90.93,45.59 180 top
R47  94.36,43.56 180 top
R48  103.5,44.58 270 top
R49  105.66,44.58 270 top
R50  107.95,44.58 90 top
R51  101.85,40.64 270 top
R52  101.35,44.58 270 top
R53  99.06,44.58 90 top
R54  102.74,52.83 0 top
R55  83.19,69.47 180 top
R56  69.34,67.69 0 top
R57  56.9,69.09 0 top
R58  56.9,66.67 0 top
R59  69.34,65.53 0 top
R60  83.19,66.93 0 top
R61  105.16,65.02 180 top
R62  109.35,65.02 180 top
R63  66.04,32 90 top
R64  53.21,48.39 180 top
R65  97.28,67.06 0 top
S1  115.95,66.8 180 top
S2  115.95,70.48 180 top
SJ1  48.77,62.87 90 bottom
XIO  123.16,52.08 270 top

### Tracks (layer width: path | path; a pad name or v marks a point on that pad's centre or on a via)
+3V3_SIKL  (via drill 0.61)
  Top 0.254: ESP_ADAPTER.6 105.92,70.61 105.16,71.37 101.73,71.37 100.84,70.48 ESP_ADAPTER.2
  Top 0.305: 90.18,33.62 IC4.4
  Top 0.381: ESP_ADAPTER2.3 ESP_ADAPTER2.4 114.55,32.89 | C33.+ 92.5,33.62 v93.09,33.02
  Top 0.508: C33.+ 90.18,33.62 | IC4.2 IC4.4
  Bottom 0.254: 125.22,72.39 123.83,72.39 | 122.68,72.39 121.41,72.39
  Bottom 0.381: v93.09,33.02 93.09,30.61 95.38,28.32 100.71,28.32 101.85,29.46 104.65,29.46 106.3,27.81 112.39,27.81 | 112.39,27.81 125.73,27.81 126.87,28.96 126.87,71.75 126.24,72.39 125.22,72.39 | 123.83,72.39 122.68,72.39 | 121.41,72.39 115.95,72.39 115.19,71.63 106.93,71.63 105.92,70.61 ESP_ADAPTER.6 | ESP_ADAPTER2.4 112.9,32.89 112.65,32.64 112.65,28.07 112.39,27.81
+5V  (via drill 0.61)
  Top 0.254: XIO.2 123.83,73.67 XIO.1 | D33.C 113.23,45.14 114.3,44.07 119.89,44.07 120.27,44.45 126.49,44.45 126.87,44.07
  Top 0.381: POWER.2 58.43,28.05 | 58.43,28.05 58.43,34.78 50.29,42.93 46.99,42.93 46.35,43.56 D7.C | 66.05,28.32 LED.A 65.77,28.32 58.42,28.32 58.43,28.05 | C16.+ 77.85,29.76 | D16.C 82.35,41.6 82.93,41.02 82.93,37.85 80.52,35.43 80.52,30.01
  Top 0.61: 80.39,29.76 77.85,29.76 77.81,29.72 73.03,29.72 71.63,28.32 66.05,28.32 POWER.5 66.05,25.89 | 80.39,29.76 82.44,29.76 IC4.3 82.8,30.02 v82.8,29.97 | 80.52,30.01 80.52,29.89 80.39,29.76 | v104.39,28.07 105.03,27.43 125.48,27.43 126.87,28.83 126.87,44.07 126.87,73.15 126.36,73.66 123.84,73.66 123.83,73.67
  Bottom 0.381: 97.79,27.05 96.27,27.56
  Bottom 0.61: 97.79,27.05 100.58,27.05 101.6,28.07 v104.39,28.07 104.39,30.73 106.55,32.89 ESP_ADAPTER1.4 ESP_ADAPTER1.3 | 96.27,27.56 83.82,27.56 82.8,28.57 v82.8,29.97
+6V  (via drill 0.61)
  Top 0.254: v47.88,60.2 47.88,64.77 46.48,66.17 46.48,68.51 D27.C
  Top 0.813: IC5.OUT 41.31,72.14 C18.+ 43.22,72.22 45.34,70.1 JP3.1 46.56,70.56 D27.C | 88.21,70.56 JP4.1 87.83,70.05 D21.C | D26.C 61.16,70.43 JP2.1 | D25.C 73.35,70.36 | 73.35,70.36 73.35,70.54 JP1.1 73.35,70.36
  Bottom 0.254: SJ1.1 48.13,60.33 v47.88,60.2
  Bottom 0.813: JP3.1 46.74,69.72 48.13,68.33 59.44,68.33 JP2.1 61.59,69.98 63.25,68.33 71.75,68.33 JP1.1 73.66,70.36 75.69,68.33 86.11,68.33 JP4.1
AIN1
  Top 0.254: R8.1 28.61,63.33 28.83,63.12 28.83,58.67 IC1.6
  Top 0.381: J1.1 24.33,32.95 23.88,33.4 23.88,60.71 26.54,63.37 27.77,63.37 R8.1
AIN2  (via drill 0.61)
  Top 0.254: R25.1 61.13,63.33 61.34,63.12 61.34,58.29 IC2.6
  Top 0.381: v58.04,58.29 58.04,62.48 58.93,63.37 60.16,63.37 R25.1
  Bottom 0.381: J2.1 41.07,32.95 42.55,34.42 42.55,42.55 44.45,44.45 54.23,44.45 56.01,46.23 56.01,56.26 v58.04,58.29
AIN3  (via drill 0.61)
  Top 0.254: R44.1 93.64,62.57 93.85,62.36 93.85,57.02 IC3.6
  Top 0.381: v82.3,49.4 87.25,49.4 88.39,50.55 88.39,59.56 91.44,62.61 92.67,62.61 R44.1
  Bottom 0.381: J3.1 54.94,33.07 57.91,30.1 76.83,30.1 78.49,31.75 78.49,38.23 77.98,38.73 77.98,45.09 v82.3,49.4
ANALOG_OUT1  (via drill 0.61)
  Top 0.254: R15.1 43.94,42.58 43.94,41.78 44.25,41.48 D7.A D32.C 48.39,39.92 C4.1
  Top 0.381: C4.1 52.2,39.75 57.53,34.42 57.53,30.23 v56.64,29.34
  Bottom 0.381: v56.64,29.34 76.33,29.34 78.87,26.8 78.87,25.53 ADCL.1
ANALOG_OUT2  (via drill 0.61)
  Top 0.254: R30.1 76.45,42.55 76.83,41.53 79.17,41.53 | 79.17,41.53 D15.C 79.25,43.31 79.63,43.69 80.77,43.69 81.03,43.94 D16.A | 79.17,41.53 79.17,39.38 C9.1
  Top 0.381: 79.17,39.38 79.17,39.32 v79.25,39.37
  Bottom 0.381: v79.25,39.37 79.25,28.45 81.28,26.42 ADCL.2
ANALOG_OUT3
  Top 0.254: R50.1 107.95,42.29 108.2,42.04 110.16,42.04 D8.C | D8.C D33.A | D8.C 110.36,40.55 C14.1
  Top 0.381: ADCL.3 83.81,28.05 85.47,29.72 90.04,29.72 91.82,31.5 94.87,31.5 95.12,31.75 95.12,36.32 97.03,38.23 105.41,38.23 107.7,40.51 C14.1 110.36,40.47
GND  (5 unrouted)
GND1  (via drill 0.61)
  Top 0.381: 45.85,71.63 50.42,71.63 v50.55,71.5
  Bottom 0.381: 45.72,71.63 50.42,71.63 50.67,71.37
  other vias: 91.95,29.08 93.09,29.08 94.49,29.08 94.49,30.23 77.09,48.01 77.09,46.86 81.92,46.99 105.92,62.48 99.31,62.48 94.61,68.83 95,70.61 93.85,70.61 92.71,70.61 77.47,71.63 78.23,70.1 80.01,71.5 81.15,70.99 85.09,70.61 86.23,70.61 85.34,66.93 86.49,66.93 70.23,65.53 66.29,67.06 70.87,63.25 64.64,63.37 57.78,66.67 51.56,70.61 52.83,70.61 54.1,70.61 55.37,70.61 58.93,70.61 59.05,66.67 41.53,63.25 44.58,46.61 45.85,46.61 47.12,46.61 48.39,46.61 36.2,45.85 36.2,47.12 53.72,48.39 54.86,48.39 53.72,50.93 54.86,50.93
  pour Bottom (isolate 0.508): 22.48,76.2 22.48,22.86 129.54,22.86 129.54,76.2
  pour Top (isolate 0.508): 22.48,76.2 22.48,22.86 129.54,22.86 129.54,76.2
GPIO2
  Top 0.254: ESP_ADAPTER.5 105.92,66.67 107.57,65.02 R62.2
N$1
  Top 0.254: R1.2 41.53,60.45 40.51,59.44 40.51,57.4 IC1.2 40.77,56.9 40.77,55.63 41.27,55.12 43.81,55.12 47.12,58.42 R3.3
N$2
  Top 0.254: C2.1 39.37,64.01 39.88,64.52 42.93,64.52 43.43,64.01 R5.2
N$3
  Top 0.254: C1.2 37.21,60.2 37.97,59.44 37.97,57.4 IC1.3 | 39.12,61.47 39.16,61.51 C2.2 C1.2 | R2.2 C1.2
N$4
  Top 0.254: R7.1 R6.1 32.51,57.53 IC1.5
N$5
  Top 0.254: C5.2 46.86,53.94 46.86,54.48 47.5,55.12 51.18,55.12 53.47,57.4 53.47,59.94 52.45,60.96 R3.2 51.94,60.2 50.67,58.93 47.24,58.93 46.74,59.44 46.74,62.99 46.52,63.21 R4.2
N$6
  Top 0.254: R16.1 34.92,39.37 R17.1
N$7  (via drill 0.61)
  Top 0.254: IC1.1 43.43,57.78 v43.43,60.96 R5.1 R4.1 | D3.C 46.41,48.64 v46.61,48.64 46.81,48.84 D9.A | v32.51,63.25 R6.2
  Bottom 0.254: IC1.1 42.93,53.34 44.83,51.44 44.83,49.15 45.34,48.64 v46.61,48.64 | v43.43,60.96 43.43,59.94 42.67,59.18 33.53,59.18 32.51,60.2 v32.51,63.25
N$8
  Top 0.254: C5.1 48.48,51.78 D9.C D3.A
N$9
  Top 0.254: R8.2 27.81,57.4 IC1.7 27.69,53.72 29.21,52.2 32,52.2 32.77,51.44 IC1.10
N$10
  Top 0.254: R19.2 39.08,47.16 40.64,45.59 40.64,38.73 R17.3
N$11  (via drill 0.61)
  Top 0.254: R13.1 v31.37,43.69 | v41.66,44.58 41.53,44.54 R14.2 41.66,45.59 40.39,46.86 IC1.13
  Bottom 0.254: v31.37,43.69 41.27,43.69 41.66,44.07 v41.66,44.58
N$12
  Top 0.254: R11.2 25.82,44.7 | 25.82,44.7 C3.1 25.82,40.99 D1.A | 25.82,44.7 29.46,44.7 29.59,44.58 29.59,43.43 R13.2 29.63,40.99 D5.A
N$13  (via drill 0.61)
  Top 0.254: v27.69,38.1 D2.A D1.C
  Bottom 0.254: IC1.9 30.23,47.24 28.7,45.72 28.7,45.21 | 28.7,45.21 28.7,39.12 v27.69,38.1 | R64.2 51.94,48.13 49.28,45.59 41.27,45.59 39.88,44.2 32.77,44.2 31.88,45.09 28.83,45.09 28.7,45.21
N$14  (via drill 0.61)
  Top 0.254: C3.2 27.52,41.11 D2.C 27.69,40.01 28.07,39.62 31.5,39.62 31.88,40.01 31.88,40.82 D6.C v31.75,41.4 | R11.1 27.52,45.94 v27.56,45.97 | v37.34,42.67 R12.2
  Bottom 0.254: v27.56,45.97 27.56,43.85 C3.2 | v31.75,41.4 33.15,42.8 37.34,42.8 v37.34,42.67
  other vias: 27.52,43.69
N$15
  Top 0.254: IC1.8 27.69,47.5 28.83,46.35 31.24,46.35 33.15,44.45 33.15,38.35 32.77,37.97 31.82,37.97 D6.A D5.C
N$16
  Top 0.254: R18.1 R12.1 37.47,44.54 37.47,49.28 IC1.12
N$17
  Top 0.254: IC1.14 42.93,46.1 43.81,45.21 R15.2 43.01,44.41 42.8,44.2 42.8,42.93 42.55,42.67 41.7,42.67 R14.1
N$18
  Top 0.254: R18.2 39.5,39.62 R17.2
N$19  (via drill 0.61)
  Top 0.254: IC2.2 72.64,59.18 72.9,59.44 74.17,59.44 v74.3,59.56 | v77.47,61.59 R9.2
  Bottom 0.254: v74.3,59.56 77.47,59.56 | 77.47,59.56 v77.47,61.59 | R20.3 80.52,58.42 79.5,59.56 77.47,59.56
N$20
  Top 0.254: C6.2 70.99,58.04 IC2.3 | R10.2 C6.2 | C6.2 C7.2
N$21
  Top 0.254: R21.2 75.31,64.01 75.56,64.26 79.25,64.26 82.55,60.96 | 82.55,60.96 R20.2 | C10.2 81.24,59.65 82.55,60.96
N$22
  Top 0.254: R23.2 62.48,64.14 62.87,64.52 65.66,64.52 | 65.66,64.52 65.66,61.85 65.91,61.59 66.64,61.59 R22.1 | 65.66,64.52 73.79,64.52 74.17,64.01 74.17,61.98 74.51,61.63 R21.1 75.31,57.28 IC2.1 75.18,53.47 76.96,51.69 79.32,51.69 D10.A D4.C
N$23
  Top 0.254: R22.2 C7.1
N$24
  Top 0.254: R23.1 R24.1 64.64,57.53 IC2.5
N$25
  Top 0.254: R25.2 60.2,57.4 IC2.7 59.94,53.85 61.85,51.94 64.01,51.94 65.02,50.93 IC2.10
N$26  (via drill 0.61)
  Top 0.254: 59.91,42.3 D13.A 59.78,42.26 C8.1 | R26.2 C8.1 | D11.A 63.5,43.05 63.25,43.31 62.1,43.31 61.89,43.52 R28.2 v61.85,44.32 | C8.1 v59.82,44.32
  Bottom 0.254: v59.82,44.32 v61.85,44.32
N$27  (via drill 0.61)
  Top 0.254: D11.C D12.A 61.77,39.24 61.21,39.24 60.83,39.62 60.83,47.12 62.48,48.77 IC2.9 | R35.2 79.12,48.13 75.95,51.31 73.03,51.31 v72.39,51.94
  Bottom 0.254: v72.39,51.94 71.37,50.93 71.37,48.01 71.12,47.75 64.64,47.75 63.5,48.9 63.12,48.9 IC2.9
N$28  (via drill 0.61)
  Top 0.254: D14.C 58.37,42.22 v58.04,42.16 | v61.85,42.16 61.65,42.16 D12.C | 58.2,42.38 D14.C | R26.1 C8.2 58.08,42.26 D14.C | R27.2 v69.6,43.31
  Bottom 0.254: v58.04,42.16 v61.85,42.16 D12.C 62.3,42.67 62.3,42.87 62.74,43.31 v69.6,43.31 69.6,43.05 69.34,43.31
N$29
  Top 0.254: D13.C D14.A 57.97,39.24 57.28,39.24 56.9,39.62 56.9,48.64 57.78,49.53 IC2.8
N$30  (via drill 0.61)
  Top 0.254: IC2.13 72.64,47.37 74.3,45.72 R29.2 | R28.1 63.59,45.68 v63.75,46.1
  Bottom 0.254: IC2.13 72.64,47.88 72.01,47.24 64.9,47.24 v63.75,46.1
N$31
  Top 0.254: IC2.12 70.1,46.61 69.6,46.1 R27.1 R32.1
N$32
  Top 0.254: IC2.14 75.18,47.12 76.45,45.85 R30.2 75.53,45.05 75.31,44.83 75.31,43.56 75.06,43.31 74.33,43.31 R29.1
N$33
  Top 0.254: D4.A D10.C 79.54,54.7 C10.1
N$34
  Top 0.254: R31.1 66.93,38.61 67.18,38.86 R33.1
N$35
  Top 0.254: R34.2 71.33,47.54 73.15,45.72 73.15,39.88 R31.3
N$36
  Top 0.254: R32.2 72.01,40.64 70.36,38.99 R31.2
N$37  (via drill 0.61)
  Top 0.254: IC3.2 105.92,58.67 R37.2 v105.92,60.83
  Bottom 0.254: v105.92,60.83 105.92,59.94 107.82,58.04 114.55,58.04 R39.3
N$38
  Top 0.254: R38.2 95.67,60.87 96.01,61.21 96.01,63.37 96.39,63.75 101.09,63.75 101.47,63.37 C11.2 101.51,62.61 102.23,62.61 102.49,62.36 102.49,60.58 | C12.2 102.58,60.49 102.49,60.58 | IC3.3 101.6,58.8 102.49,59.69 102.49,60.58
N$39
  Top 0.254: R40.2 112.94,62.32 R39.2 116.59,59.94 117.22,59.31 117.22,57.66 115.57,56.01 C15.2
N$40  (via drill 0.61)
  Top 0.254: D23.C D24.A 109.15,51.18 107.95,51.18 106.68,52.45 IC3.1 108.08,58.29 R41.1 R40.1 | R42.2 97.5,62.57 v97.54,62.61
  Bottom 0.254: v97.54,62.61 97.92,62.61 98.17,62.36 98.17,59.82 99.19,58.8 104.78,58.8 IC3.1
N$41
  Top 0.254: R41.2 108.08,63.12 107.7,63.5 104.14,63.5 103.76,63.12 C12.1
N$42
  Top 0.254: IC3.5 97.16,57.53 R42.1 R43.1
N$43
  Top 0.254: R44.2 92.71,58.17 IC3.7 91.44,53.09 92.71,51.82 95.63,51.82 96.52,50.93 IC3.10
N$44  (via drill 0.61)
  Top 0.254: v90.04,41.4 90.12,41.45 D17.A 90.08,41.37 C13.1 R46.2 | R48.2 103.5,42.42 v102.62,41.53
  Top 0.381: D19.A 94.05,41.45 v93.73,41.4
  Bottom 0.254: v90.04,41.4 v93.73,41.4 102.49,41.4 v102.62,41.53
N$45
  Top 0.254: D18.A D17.C 90.62,38.35 88.77,38.35 88.39,38.73 88.39,49.15 90.55,51.31 93.6,51.31 93.98,50.93 IC3.9
  Bottom 0.254: IC3.9 93.98,47.88 94.61,47.24 114.43,47.24 R36.2
N$46
  Top 0.254: R46.1 C13.2 | C13.2 91.78,41.49 D18.C | C13.2 R47.2 93.51,42.76 93.73,42.55 95.12,42.55 95.38,42.29 D20.C
N$47  (via drill 0.61)
  Top 0.254: D20.A D19.C 93.55,38.3 v93.73,38.48
  Bottom 0.254: v93.73,38.48 90.3,38.48 89.03,39.75 89.03,46.86 IC3.8
N$48
  Top 0.254: IC3.13 104.14,46.99 103.5,46.35 R48.1 104.31,45.43 104.65,45.09 104.65,43.94 104.9,43.69 105.62,43.69 R49.2
N$49  (via drill 0.61)
  Top 0.254: v101.35,45.59 101.13,44.92 R52.1 101.6,45.17 IC3.12 | v95.12,43.56 95,43.6 R47.1
  Bottom 0.254: v101.35,45.59 100.58,45.59 100.33,45.34 100.33,42.42 99.69,41.91 96.01,41.91 95.25,42.67 95.25,43.52 R47.1 v95.12,43.56
N$50  (via drill 0.61)
  Top 0.254: IC3.14 106.68,47.62 107.95,46.35 v107.95,45.47 | v107.95,45.47 R50.2 107.86,45.59 v107.95,45.47 | R49.1 v105.66,45.47
  Bottom 0.254: v105.66,45.47 v107.95,45.47
N$51
  Top 0.254: D23.A D24.C 109.39,54.32 C15.1
N$52
  Top 0.254: R53.1 99.06,39.75 R51.1
N$53
  Top 0.254: R54.2 104.78,52.83 105.41,52.2 105.41,47.5 106.81,46.1 106.81,40.89 105.28,39.37 R51.3
N$54
  Top 0.254: R52.2 101.35,40.01 R51.2
N$55
  Top 0.254: D26.A 64.06,66.43 Q3.3
  Top 0.813: JP2.2 64.14,68.78 D26.A
N$56
  Top 0.254: D27.A Q2.3
  Top 0.813: D27.A 49.46,70.56 JP3.2
N$57
  Top 0.381: D25.A Q1.3
  Top 0.813: JP1.2 76.2,68.38 D25.A
N$58
  Top 0.254: Q2.1 56.24,66.49 R58.1 R57.1
N$59
  Top 0.254: Q3.1 68.43,65.47 R59.1 R56.1
N$60
  Top 0.254: D21.A Q4.3
  Top 0.813: D21.A 90.73,70.31 JP4.2
N$61
  Top 0.254: R55.1 84.03,68.67 83.69,68.33 82.68,68.33 82.3,67.94 82.3,67.22 R60.1 82.4,67 80.22,67 Q1.1
N$62
  Top 0.254: R61.1 106.01,64.17 106.17,64.01 107.95,64.01 108.46,63.5 112.01,63.5 112.78,64.26 112.78,66.78 S1.2
N$63
  Top 0.254: R62.1 110.2,69.56 111.12,70.48 S2.2
N$64
  Top 0.61: LED.C R63.1
N$65
  Top 0.254: Q4.1 96.37,67 R65.1 96.52,67.14 96.52,67.82 96.9,68.2 97.66,68.2 98.13,68.67 R45.1
N$67  (via drill 0.61)
  other vias: 87.76,15.88
PB0
  Top 0.254: XIO.34 124.44,34.06 124.21,34.29 120.65,34.29 119.51,35.43 ESP_ADAPTER2.5
PB1
  Bottom 0.254: XIO.33 120,33.03 119.38,33.66 119.38,38.61 117.98,40.01 114.17,40.01 112.9,38.73 112.9,35.94 113.41,35.43 ESP_ADAPTER2.6
PB2
  Top 0.254: XIO.32 124.44,36.73 124.33,36.83 120.52,36.83 119.38,37.97 ESP_ADAPTER2.7
PB3  (via drill 0.61)
  Top 0.254: XIO.31 120.51,35.57 119.38,36.7 v118.36,36.7
  Bottom 0.254: v118.36,36.7 118.36,38.73 117.73,39.37 116.08,39.37 ESP_ADAPTER2.8
PWM1
  Top 0.254: R57.2 57.75,71.46 58.04,71.75 71.12,71.75 73.03,73.66 PWML.8
PWM2
  Top 0.254: PWML.7 76.21,72.28 75.69,71.75 72.14,71.75 70.23,69.85 70.23,67.73 R56.2
PWM3
  Top 0.254: PWML.6 78.75,70.98 80.01,69.72 82.08,69.72 R55.2
PWM4
  Top 0.254: PWML.5 81.29,72.63 82.17,71.75 95.63,71.75 96.9,70.48 96.9,69.38 R45.2
RST  (1 unrouted)
RX  (1 unrouted)
SCL  (1 unrouted)
  Top 0.254: COMMUNICATION.1 114.29,72.25
SDA  (1 unrouted)
TX  (1 unrouted)
V+  (via drill 0.61)
  Top 0.254: IC2.4 67.56,54.61 68.58,53.59 v69.6,53.59 | v69.6,53.59 R34.1 69.64,53.63 v69.6,53.59 | v35.69,60.07 35.31,59.69 IC1.4 35.31,54.1 36.07,53.34 R19.1 | IC3.4 99.06,53.98 100.08,52.96 101.77,52.96 R54.1
  Bottom 0.254: v35.69,60.07 35.94,60.07 36.32,59.69 41.53,59.69 42.16,60.33 42.16,61.21 42.93,61.98 46.23,61.98 47.12,62.87 SJ1.2 50.42,62.87 51.18,62.1 55.88,62.1 58.67,59.31 66.04,59.31 67.56,57.78 IC2.4 | v69.6,53.59 69.6,53.72 70.74,55.37 86.74,55.37 90.3,58.93 98.17,58.93 99.06,58.04 IC3.4
V-  (via drill 0.61)
  Top 0.254: IC1.11 v35.31,49.53 34.92,49.15 R16.2 | IC2.11 67.56,46.61 67.18,46.23 R33.2 | IC3.11 R53.2 | v40.77,51.94 43.56,51.94 45.34,50.16 50.55,50.16 50.93,49.78 56.77,49.78 58.67,51.69 59.82,51.69 v60.2,52.07
  Bottom 0.254: IC2.11 67.56,52.07 | IC3.11 98.93,49.4 98.93,51.18 98.3,51.82 74.04,51.82 72.9,52.96 70.36,52.96 69.47,52.07 67.56,52.07 | v35.31,49.53 35.31,51.05 35.94,51.69 40.51,51.69 v40.77,51.94 | v60.2,52.07 67.56,52.07
VCC  (via drill 0.81)
  Top 0.254: 36.79,67.1 IC5.IN
  Top 0.813: 36.79,67.1 C17.+ 31.58,67.06 v30.73,67.06
  Bottom 0.254: IC5.IN 36.83,65.91 37.59,65.15 48.64,65.15 SJ1.3
  Bottom 0.813: POWER.8 73.67,27.04 72.77,27.94 55.24,27.94 51.94,24.64 25.53,24.64 24,26.16 24,64.14 26.92,67.06 v30.73,67.06